# Altium schematic sheet Sheet1.SchDoc
size A; SheetNumber: 3; SheetTotal: 3
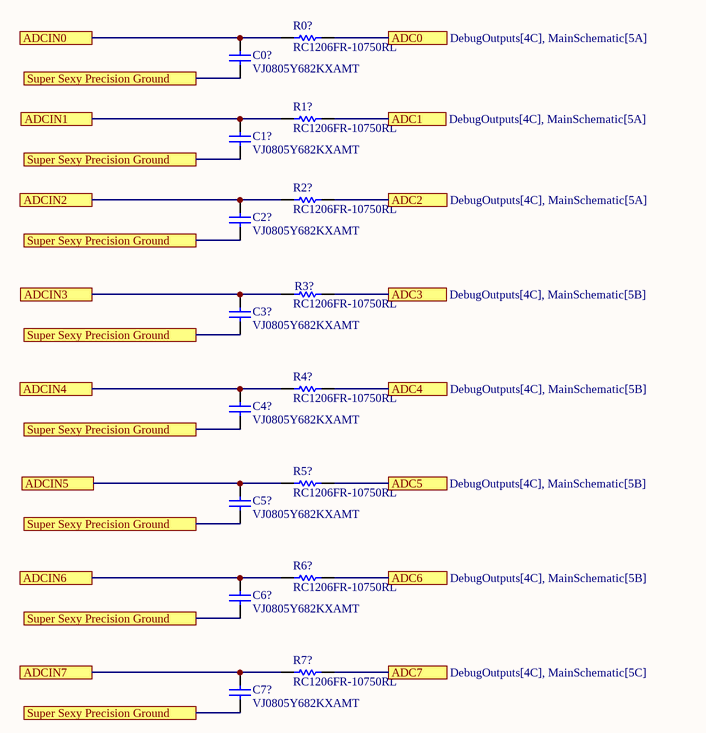
[diagram p0: Sheet1.SchDoc]

## Parts
C0?  VJ0805Y682KXAMT  [CAPC2013X145X48ML20T23]
C1?  VJ0805Y682KXAMT  [CAPC2013X145X48ML20T23]
C2?  VJ0805Y682KXAMT  [CAPC2013X145X48ML20T23]
C3?  VJ0805Y682KXAMT  [CAPC2013X145X48ML20T23]
C4?  VJ0805Y682KXAMT  [CAPC2013X145X48ML20T23]
C5?  VJ0805Y682KXAMT  [CAPC2013X145X48ML20T23]
C6?  VJ0805Y682KXAMT  [CAPC2013X145X48ML20T23]
C7?  VJ0805Y682KXAMT  [CAPC2013X145X48ML20T23]
R0?  RC1206FR-10750RL  [RESC3116X65X40LL10T20]
R1?  RC1206FR-10750RL  [RESC3116X65X40LL10T20]
R2?  RC1206FR-10750RL  [RESC3116X65X40LL10T20]
R3?  RC1206FR-10750RL  [RESC3116X65X40LL10T20]
R4?  RC1206FR-10750RL  [RESC3116X65X40LL10T20]
R5?  RC1206FR-10750RL  [RESC3116X65X40LL10T20]
R6?  RC1206FR-10750RL  [RESC3116X65X40LL10T20]
R7?  RC1206FR-10750RL  [RESC3116X65X40LL10T20]

## Ports
ADC0 (see DebugOutputs[4C], MainSchematic[5A]), ADC1 (see DebugOutputs[4C], MainSchematic[5A]), ADC2 (see DebugOutputs[4C], MainSchematic[5A]), ADC3 (see DebugOutputs[4C], MainSchematic[5B]), ADC4 (see DebugOutputs[4C], MainSchematic[5B]), ADC5 (see DebugOutputs[4C], MainSchematic[5B]), ADC6 (see DebugOutputs[4C], MainSchematic[5B]), ADC7 (see DebugOutputs[4C], MainSchematic[5C]), ADCIN0 (see MainSchematic[2B]), ADCIN1 (see MainSchematic[2C]), ADCIN2 (see MainSchematic[2C]), ADCIN3 (see MainSchematic[2C]), ADCIN4 (see MainSchematic[2C]), ADCIN5 (see MainSchematic[2C]), ADCIN6 (see MainSchematic[2C]), ADCIN7 (see MainSchematic[2C]), Super Sexy Precision Ground (see MainSchematic[1A], MainSchematic[2C], MainSchematic[4A], MainSchematic[4B], MainSchematic[4C], MainSchematic[5C], Sheet1[1A], Sheet1[1B], Sheet1[1C])

## Nets
ADC0: R0?.2 ; port ADC0
ADC1: R1?.2 ; port ADC1
ADC2: R2?.2 ; port ADC2
ADC3: R3?.2 ; port ADC3
ADC4: R4?.2 ; port ADC4
ADC5: R5?.2 ; port ADC5
ADC6: R6?.2 ; port ADC6
ADC7: R7?.2 ; port ADC7
ADCIN0: C0?.2 R0?.1 ; port ADCIN0
ADCIN1: C1?.2 R1?.1 ; port ADCIN1
ADCIN2: C2?.2 R2?.1 ; port ADCIN2
ADCIN3: C3?.2 R3?.1 ; port ADCIN3
ADCIN4: C4?.2 R4?.1 ; port ADCIN4
ADCIN5: C5?.2 R5?.1 ; port ADCIN5
ADCIN6: C6?.2 R6?.1 ; port ADCIN6
ADCIN7: C7?.2 R7?.1 ; port ADCIN7
Super Sexy Precision Ground: C0?.1 C1?.1 C2?.1 C3?.1 C4?.1 C5?.1 C6?.1 C7?.1 ; port Super Sexy Precision Ground

## Library data of the parts
C0? C1? C2? C3? C4? C5? C6? C7? = CMP-2007-03205-1: Manufacturer: Vitramon; Part Number: VJ0805Y682KXAMT
R0? R1? R2? R3? R4? R5? R6? R7? = CMP-2003-04964-1: Manufacturer: Yageo; Part Number: RC1206FR-10750RL